# Altium schematic sheet PSU.SchDoc
size A3
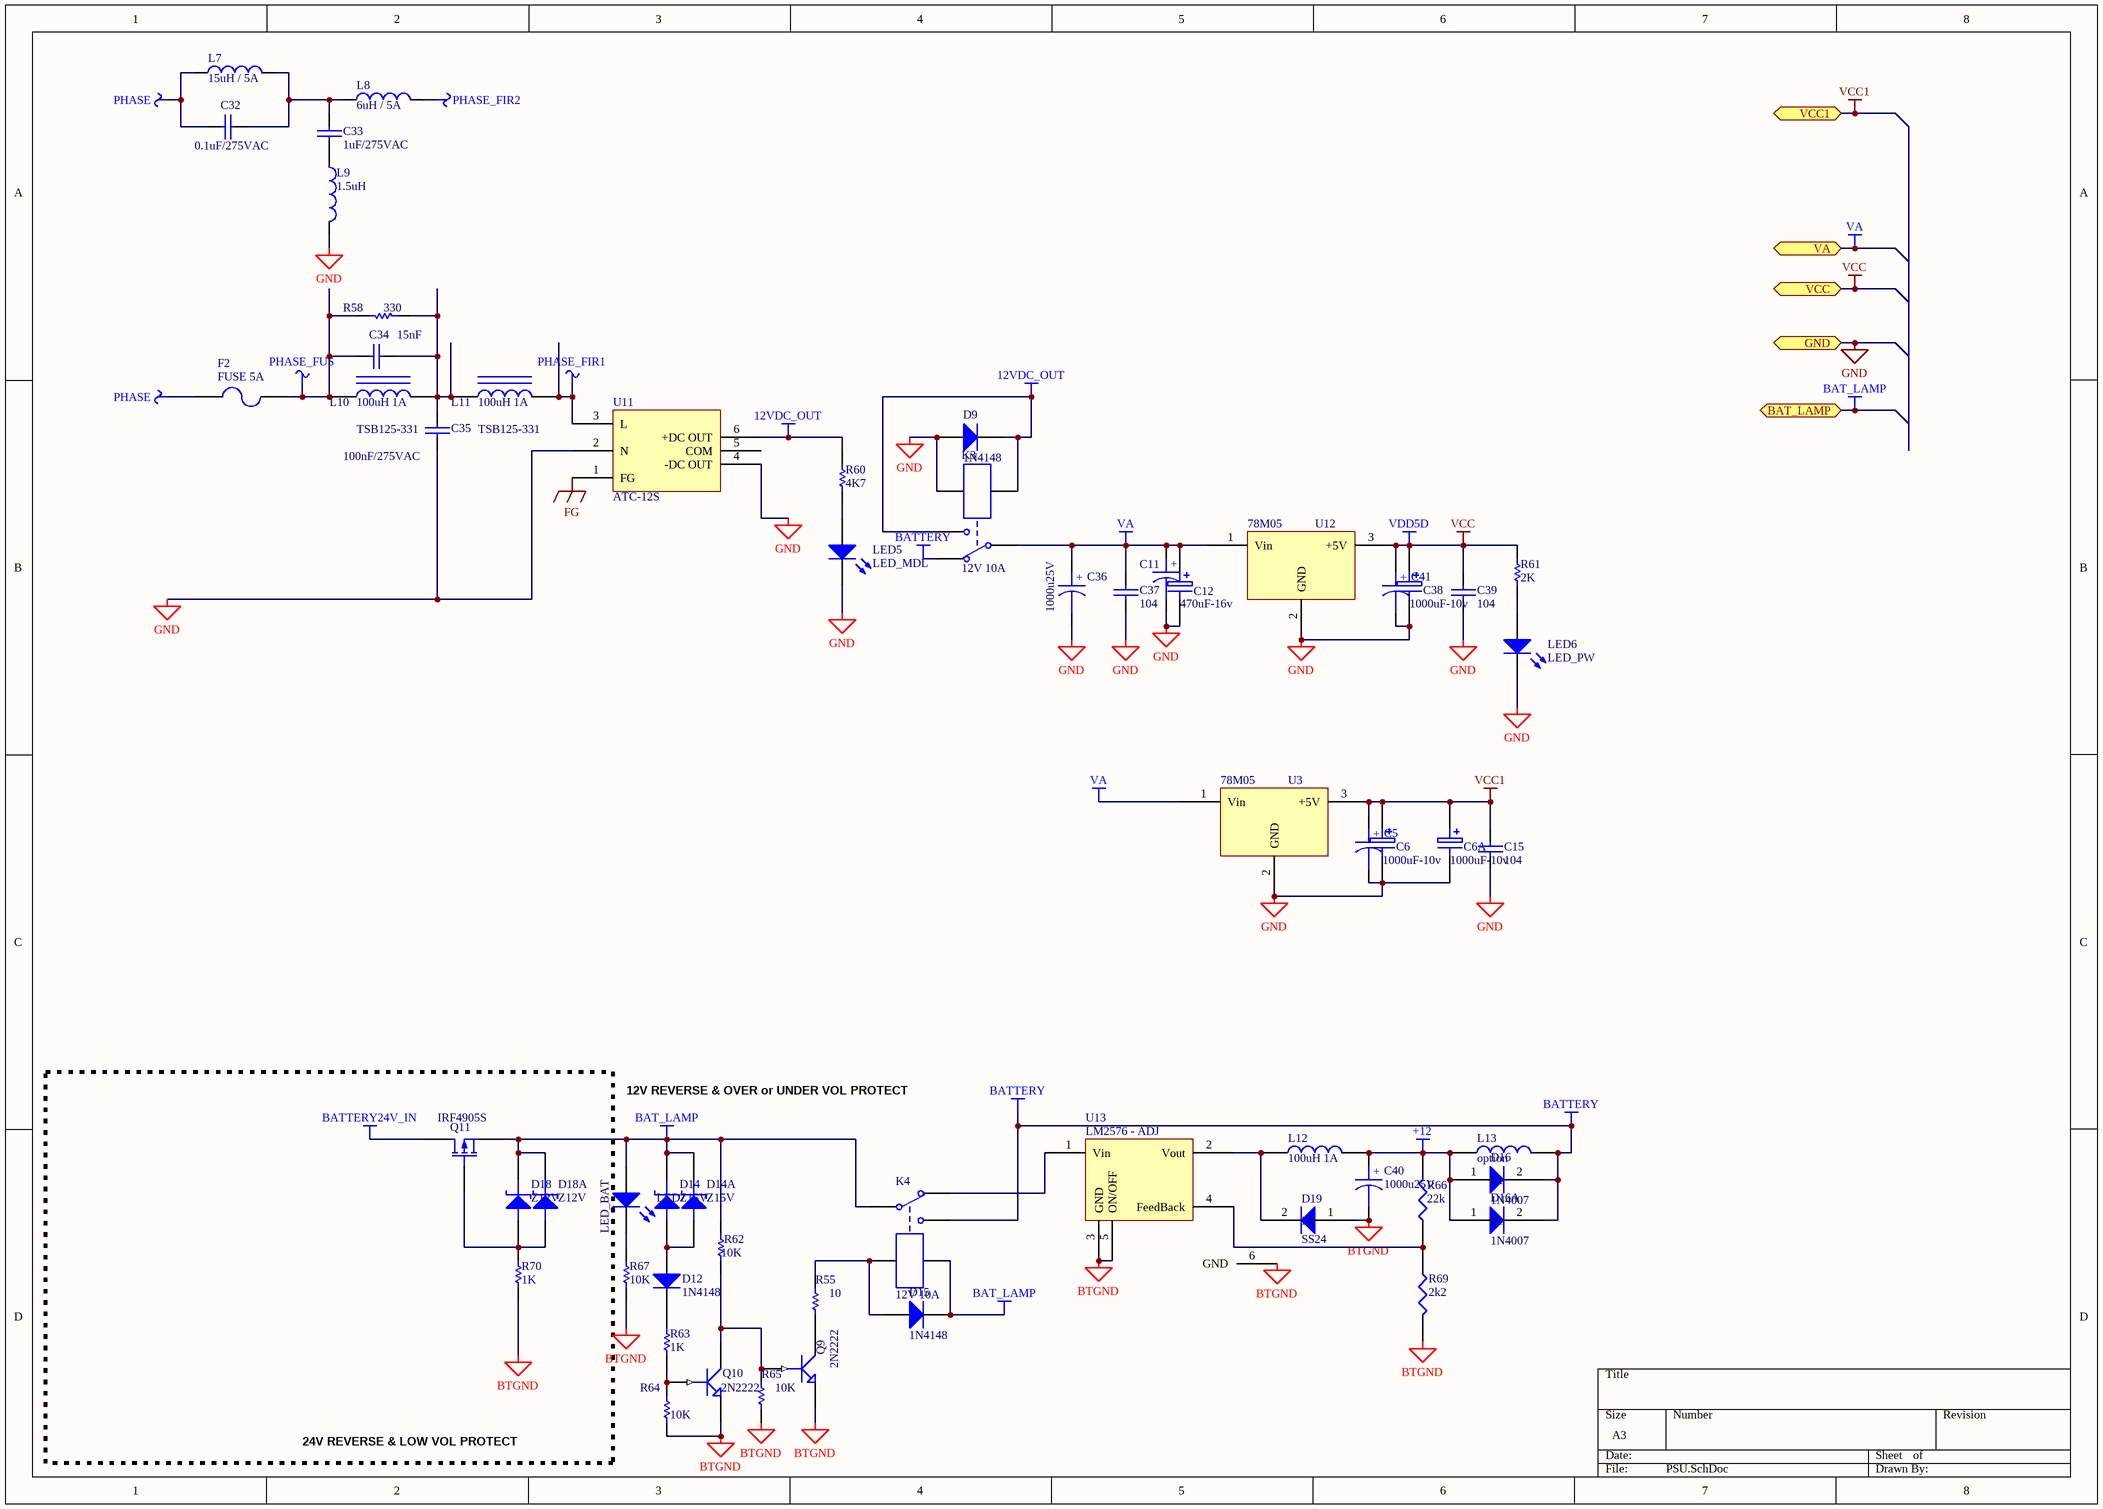
[diagram p0: PSU.SchDoc]

## Parts
C5  1000u25V  [CAP40x20]  (value not drawn)
C6  1000uF-10v  [CAP_ELEC_SIZE_E]
C6A  1000uF-10v  [CAP_ELEC_SIZE_E]
C11  1000u25V  [CAP40x20]  (value not drawn)
C12  470uF-16v  [CAP_ELEC_SIZE_E]
C15  104  [C6-0805_N]
C32  0.1uF/275VAC  [100n400v]
C33  1uF/275VAC  [CAP1.2/0.5]
C34  15nF  [R3216[1206]]
C35  100nF/275VAC  [100n400v]
C36  1000u25V  [CAP40x20]
C37  104  [C6-0805_N]
C38  1000uF-10v  [CAP_ELEC_SIZE_E]
C39  104  [C6-0805_N]
C40  1000u25V  [CAP40x20]
C41  1000u25V  [CAP40x20]  (value not drawn)
D9  1N4148  [SOD80, LL-34]
D12  1N4148  [SOD80, LL-34]
D14  Z15V  [DO-35]
D14A  Z15V  [SOT23-3]
D15  1N4148  [SOD80, LL-34]
D16  1N4007  [DO-214AA]
D16A  1N4007  [DO-214AA]
D18  Z12V  [DO-35]
D18A  Z12V  [SOD80, LL-34]
D19  SS24  [DO-214AA]
F2  FUSE 5A  [FUSE2]
K3  12V 10A  [RELAYVUONG]
K4  12V 10A  [RELAYVUONG]
L7  15uH / 5A  [IND26x8]
L8  6uH / 5A  [IND15X7]
L9  1.5uH  [IND15x7]
L10  100uH 1A  value TSB125-331  [IND1207]
L11  100uH 1A  value TSB125-331  [IND1207]
L12  100uH 1A  [IND1207]
L13  option  [axial-0.3]
LED5  LED_MDL  [LED3mm]
LED6  LED_PW  [LED3mm]
LED7  LED_BAT  [LED3mm]
Q9  2N2222  [SOT23-3]
Q10  2N2222  [SOT23-3]
Q11  IRF4905S  [D2PAK-3]
R55  10  [6-0805_N]
R58  330  [R3216[1206]]
R60  4K7  [6-0805_N]
R61  2K  [6-0805_N]
R62  10K  [6-0805_N]
R63  1K  [6-0805_N]
R64  10K  [6-0805_N]
R65  10K  [6-0805_N]
R66  22k  [6-0805_N]
R67  10K  [6-0805_N]
R69  2k2  [6-0805_N]
R70  1K  [6-0805_N]
U3  78M05  [D2PAK-3]
U11  ATC-12S  [ATC MODULE]
U12  78M05  [D2PAK-3]
U13  LM2576 - ADJ  [TO-263-5]

## Blocks framed on the sheet
24V REVERSE & LOW VOL PROTECT: D18 D18A Q11 R70

## Ports
BAT_LAMP, GND, VA, VCC, VCC1

## Nets
12VDC_OUT: D9.2(K) K3.3 K3.4 R60.2 U11.6(+DC_OUT)
+12: C40.1 D16.1 D16A.1 L12.2 L13.1 R66.2
BAT_LAMP: D14.2(K) D14A.2(K) D15.2(K) D18.2(K) D18A.2(K) K4.1 K4.5 LED7.1(A) Q11.3(S) R62.2 ; port BAT_LAMP
BATTERY: D16.2 D16A.2 K3.2 K4.3 L13.2
BATTERY24V_IN: Q11.2(D)
BTGND: C40.2 D19.1 Q9.2(E) Q10.2(E) R64.1 R65.1 R67.1 R69.2 R70.1 U13.3(GND) U13.5(ON/OFF) U13.6(GND)
FG: U11.1(FG)
GND: C5.2 C6.2 C6A.2 C11.2 C12.2 C15.2 C35.1 C36.2 C37.2 C38.2 C39.2 C41.2 D9.1(A) K3.5 L9.2 LED5.2(K) LED6.2(K) U3.2(GND) U11.2(N) U11.4(-DC_OUT) U12.2(GND) ; port GND
PHASE: C32.2 F2.1 L7.1
PHASE_FIR1: L11.2 U11.3(L)
PHASE_FIR2: L8.2
PHASE_FUS: C34.1 F2.2 L10.1 R58.2
VA: C11.1 C12.1 C36.1 C37.1 K3.1 U3.1(Vin) U12.1(Vin) ; port VA
VCC: C38.1 C39.1 C41.1 R61.2 U12.3(+5V) ; port VCC  [also labelled VDD5D]
VCC1: C5.1 C6.1 C6A.1 C15.1 U3.3(+5V) ; port VCC1
NetC32_1: C32.1 C33.1 L7.2 L8.1
NetC33_2: C33.2 L9.1
NetC34_2: C34.2 C35.2 L10.2 L11.1 R58.1
NetD12_1: D12.1(A) D14.1(A) D14A.1(A)
NetD12_2: D12.2(K) R63.2
NetD15_1: D15.1(A) K4.4 R55.2
NetD18_1: D18.1(A) D18A.1(A) Q11.1(G) R70.2
NetD19_2: D19.2 L12.1 U13.2(Vout)
NetK4_2: K4.2 U13.1(Vin)
NetLED5_1: LED5.1(A) R60.1
NetLED6_1: LED6.1(A) R61.1
NetLED7_2: LED7.2(K) R67.2
NetQ9_1: Q9.1(B) Q10.3(C) R62.1 R65.2
NetQ9_3: Q9.3(C) R55.1
NetQ10_1: Q10.1(B) R63.1 R64.2
NetR66_1: R66.1 R69.1 U13.4(FeedBack)

Not connected (* = marked no-connect by the designer): U11 5(COM)

## Notes on the sheet
- 12V REVERSE & OVER or UNDER VOL PROTECT
- (in symbol CAPACITOR POL) +

## Library data of the parts
C5 C11 C36 C40 C41 = CAPACITOR POL: Capacitor
C6 C6A C12 C38 = ELECTRO1: Electrolytic Capacitor
C15 C34 C37 C39 = CAP: Capacitor
C32 = CAP: 0.1uF/275VAC X2
C33 = CAP: 1uF/275VAC X2
C35 = CAP: 100nF/275VAC X2
D9 D12 D15 = Diode 1N4007: 1 Amp General Purpose Rectifier; pin to pad: 1>A 2>K; Published: 8-Jun-2000; LatestRevisionDate: 17-Jul-2002; LatestRevisionNote: Re-released for DXP Platform.; DatasheetDocument: 1998; PackageDocument: Aug-1999; PackageReference: DO-41; Publisher: Altium Limited; Code_JEDEC: DO-204-AL; ComponentLink1Description: Manufacturer Link; ComponentLink1URL: http://www.fairchildsemi.com/; ComponentLink2Description: Datasheet; ComponentLink2URL: http://www.fairchildsemi.com/ds/1N%2F1N4001.pdf
D14 D18 = ZENER2: Zener Diode
D14A = ZENER2: Zener Diode; pin to pad: 2>3
D16 D16A D19 = DIODE: Hoangphat; pin to pad: 1>A 2>K
D18A = ZENER2: Zener Diode; pin to pad: 1>A 2>K
F2 = FUSE2: Fuse
K3 K4 = Relay-SPDT: G5LA-10A/250VAC / SRC-12VDC-SL-C; Published: 24-Mar-1999; LatestRevisionDate: 17-Jul-2002; LatestRevisionNote: Re-released for DXP Platform.; PackageReference: MODULE5B; Publisher: Altium Limited
L7-L9 = Inductor: Toirodal Inductor; Code_IEC: 1005; Published: 8-Jun-2000; LatestRevisionDate: 29-May-2009; LatestRevisionNote: IPC-7351 Footprint Added.; PackageReference: 0402-A; Publisher: Altium Limited; PackageDescription: Chip Inductor; Code_JEITA: 0402
  L7: Value: 15uH / 5A
  L8: Value: 6uH / 5A
  L9: Value: 1.5uH
L10 L11 = INDUCTOR IRON: 100uH 1A SMD HP
L12 L13 = INDUCTOR
LED5-LED7 = LED3: Typical BLUE SiC LED; Published: 8-Jun-2000; LatestRevisionDate: 17-Dec-2003; LatestRevisionNote: PCB Footprint replaced.; DatasheetVersion: 16-Apr-2002; PackageVersion: 16-Apr-2002; PackageReference: 3.5X2.8X1.9; Publisher: Altium Limited; PackageDescription: SM LED; 2 C-Bend Leads; Body 3.5 x 2.8 x 1.9 mm, inc leads (LxWxH typ)
Q9 Q10 = NPN1: NPN Transistor
Q11 = MOSFET-P: HEXFET Power P MOSFET; pin to pad: 2>4; Published: 8-Jun-2000; LatestRevisionDate: 17-Jul-2002; LatestRevisionNote: Re-released for DXP Platform.; PackageVersion: 1995/1996; PackageReference: E3; Publisher: Altium Limited; PackageDescription: TO, Flat Index; 3 In-Line, Axial Leads; Body Dia. 4.6mm; Lead Dia. 0.5 mm (max)
R55 R60-R65 R67 R70 = Res Semi: Semiconductor Resistor; Published: *; LatestRevisionDate: *; LatestRevisionNote: *; PackageReference: *; Publisher: *; Value: *
R58 = Res Semi: Semiconductor Resistor; Value: 2K2; Published: 8-Jun-2000; LatestRevisionDate: 17-Jul-2002; LatestRevisionNote: Re-released for DXP Platform.; PackageReference: AXIAL-0.5; Publisher: Altium Limited
R66 R69 = RES1
U3 U12 = MC7805T: pin to pad: 2>4
U11 = Component_1
U13 = LM2576